# Altium schematic sheet Gas_Sampler-Flow_Sensor.SchDoc: Flow Sensor
size Tabloid; Organization: Sensible Robotics LLC; Address1: 120 E Church Ave Suite B; Address2: Ridgecrest CA, 93555; Revision: 0; SheetNumber: 12; SheetTotal: 12; ApprovedBy: Approved Name; Engineer: Mike Licitra; PageSetup: Record=PageOptions|CenterHorizontal=True|CenterVertical=True|PrintScale=0.98|XCorrection=1.00|YCorrection=1.00|PrintKind=0|BorderSize=5000000|LeftOffset=0|BottomOffset=0|Orientation=2|PaperLength=1000|PaperWidth=1000|Scale=100|PaperSource=15|PrintQuality=600|MediaType=1|DitherType=10|PaperKind=Tabloid|PrintScaleMode=1
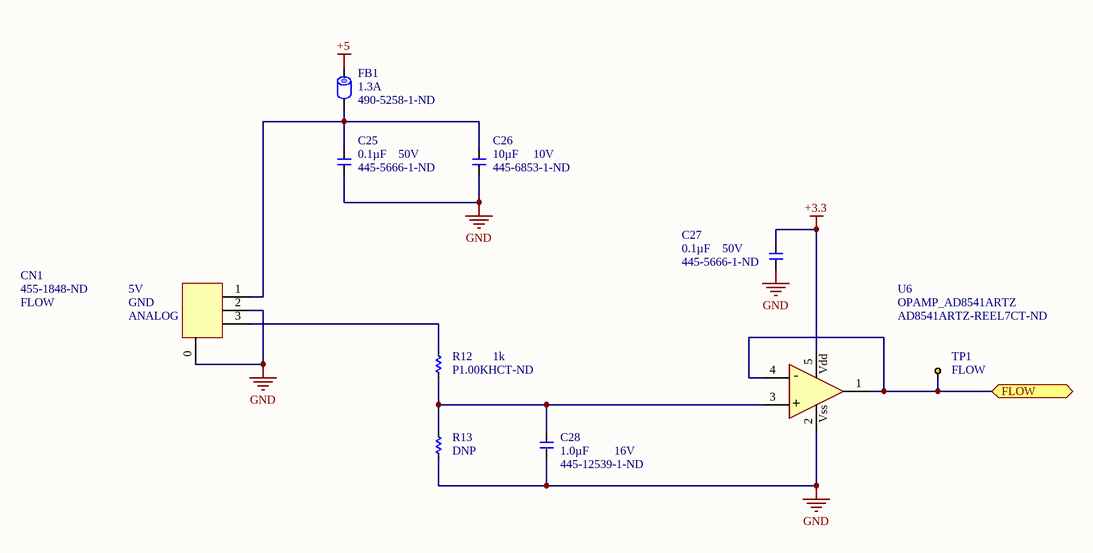
[diagram p0: Gas_Sampler-Flow_Sensor.SchDoc]

## Parts
C25  value 0.1µF  Voltage - Rated: 50V  Supplier Part Number 1: 445-5666-1-ND  [C0603]  (hidden comment: CAP_CER_0603_0.1UF_50V_10%_X7R)
C26  value 10µF  Voltage - Rated: 10V  Supplier Part Number 1: 445-6853-1-ND  [C0603]  (hidden comment: CAP_CER_0603_10UF_10V_20%_X5R)
C27  value 0.1µF  Voltage - Rated: 50V  Supplier Part Number 1: 445-5666-1-ND  [C0603]  (hidden comment: CAP_CER_0603_0.1UF_50V_10%_X7R)
C28  value 1.0µF  Supplier Part Number 1: 445-12539-1-ND  Voltage - Rated: 16V  [C0603]  (hidden comment: CAP_CER_0603_1UF_16V_10%_X7R)
CN1  FLOW  Supplier Part Number 1: 455-1848-ND  [JST_PA_S03B-PASK-2]
FB1  Current Rating (Max): 1.3A  Supplier Part Number 1: 490-5258-1-ND  [R0603]  (hidden comment: FERRITE_BEAD_0603_1.3A_600_OHM)
R12  value 1k  Supplier Part Number 1: P1.00KHCT-ND  [R0603]  (hidden comment: RES_0603_1K_OHM_1/10W_1%)
R13  value DNP  [R0603]  (hidden comment: RES_0603_DNP)  (no BOM)
TP1  FLOW  [TP_KEYSTONE_5001]
U6  OPAMP_AD8541ARTZ  Supplier Part Number 1: AD8541ARTZ-REEL7CT-ND  [5SOT23]

## Ports
FLOW

## Nets
+3.3: C27.1 U6.5(VDD)
+5: FB1.1
GND: C25.2 C26.2 C27.2 C28.2 CN1.0(CHAS) CN1.2 R13.1 U6.2(VSS)
FLOW: TP1.1 U6.1(OUT) U6.4(IN-) ; port FLOW
NetC25_1: C25.1 C26.1 CN1.1 FB1.2
NetC28_1: C28.1 R12.1 R13.2 U6.3(IN+)
NetCN1_3: CN1.3 R12.2

## Notes on the sheet
- 5V
- (near CN1) GND
- (near CN1) ANALOG
- CONFIDENTIAL DOCUMENT
- DUPLICATION PROHIBITED
- ENGINEER
- PCB FAB #
- SCH #
- REV
- Sensible
- Robotics
- THIS DOCUMENT CONTAINS INFORMATION AND OR DATA, WHICH IS PROPRIETARY AND CONFIDENTIAL TO SENSIBLE ROBOTICS LLC.  THIS INFORMATION AND OR DATA, IS TO BE USED ONLY FOR THE BENEFIT OF THE SUPPLIER, AND IS NOT TO BE USED FOR THE BENEFIT OF OTHER PARTIES WITHOUT WRITTEN CONSENT.
- DATE
- PCB ASSY #
- SIZE
- Tabloid
- SHEET
- OF
- FILE
- (in symbol OPAMP_AD8541ARTZ) Vdd; +; Vss

## Library data of the parts
C25 C27 = CAP_CER_0603_0.1UF_50V_10%_X7R: CAP CER 0.1UF 50V 10% X7R 0603; Manufacturer: TDK Corporation; Manufacturer Part Number: CGA3E2X7R1H104K080AA; Part Number: 150-00077-00; Supplier 1: Digi-Key; RoHS: RoHS Compliant; Category: Capacitors; Stock 1: 320000; Pricing 1: 1=0.1, 10=0.072, 100=0.033, 250=0.027, 500=0.0231, 1000=0.018 (USD); Packaging: Cut Tape (CT); Tolerance: ±10%; Temperature Coefficient: X7R; Mounting Type: Surface Mount, MLCC; Operating Temperature: -55°C ~ 125°C; Applications: Automotive; Ratings: AEC-Q200; Package / Case: 0603 (1608 Metric); Size / Dimension: 0.063" L x 0.031" W (1.60mm x 0.80mm); Height - Seated (Max): -; Thickness (Max): 0.035" (0.90mm); Lead Spacing: -; Features: -; Lead Style: -; ComponentLink1URL: http://product.tdk.com/capacitor/mlcc/en/documents/mlcc_automotive_general_en.pdf; ComponentLink1Description: http://product.tdk.com/capacitor/mlcc/en/documents/mlcc_automotive_general_en.pdf
C26 = CAP_CER_0603_10UF_10V_20%_X5R: CAP CER 10UF 10V X5R 0603; Manufacturer: TDK Corporation; Manufacturer Part Number: C1608X5R1A106M080AC; Tolerance: ±20%; Supplier 1: Digi-Key; RoHS: RoHS Compliant; Packaging: Cut Tape (CT); Part Status: Active; Temperature Coefficient: X5R; Operating Temperature: -55°C ~ 85°C; Features: Low ESL; Applications: General Purpose; Mounting Type: Surface Mount, MLCC; Package / Case: 0603 (1608 Metric); Size / Dimension: 0.063" L x 0.032" W (1.60mm x 0.80mm); Thickness (Max): 0.035" (0.90mm); ComponentLink1URL: https://product.tdk.com/info/en/catalog/datasheets/mlcc_commercial_general_en.pdf; ComponentLink1Description: https://product.tdk.com/info/en/catalog/datasheets/mlcc_commercial_general_en.pdf
C28 = CAP_CER_0603_1UF_16V_10%_X7R: CAP CER 1UF 16V 10% X7R 0603; Manufacturer: TDK Corporation; Manufacturer Part Number: CGA3E1X7R1C105K080AC; Supplier 1: Digi-Key; RoHS: RoHS Compliant; Packaging: Cut Tape (CT); Tolerance: ±10%; Temperature Coefficient: X7R; Mounting Type: Surface Mount, MLCC; Operating Temperature: -55°C ~ 125°C; Applications: Automotive; Ratings: AEC-Q200; Package / Case: 0603 (1608 Metric); Size / Dimension: 0.063" L x 0.031" W (1.60mm x 0.80mm); Thickness (Max): 0.035" (0.90mm); ComponentLink1URL: http://product.tdk.com/capacitor/mlcc/en/documents/mlcc_automotive_general_en.pdf; ComponentLink1Description: http://product.tdk.com/capacitor/mlcc/en/documents/mlcc_automotive_general_en.pdf
CN1 = JST_PA_RA_TH_GUIDE_3POS: CONN HEADER PA 3POS SIDE 2MM TIN; Manufacturer: JST Sales America Inc.; Manufacturer Part Number: S03B-PASK-2(LF)(SN); Connector Type: Header, Shrouded; Number of Positions: 3; Number of Positions Loaded: All; Pitch: 0.079" (2.00mm); Supplier 1: Digi-Key; Packaging: Bulk; Contact Type: Male Pin; Contact Mating Length: 0.126" (3.20mm); Mounting Type: Through Hole, Right Angle; Termination: Kinked Pin, Solder; Fastening Type: Locking Ramp; Features: Board Guide; ComponentLink1URL: http://www.jst-mfg.com/product/pdf/eng/ePA-F.pdf; ComponentLink1Description: http://www.jst-mfg.com/product/pdf/eng/ePA-F.pdf
FB1 = FERRITE_BEAD_0603_1.3A_600_OHM: FERRITE BEAD 600 OHM 0603 1LN; Manufacturer: Murata Electronics North America; Manufacturer Part Number: BLM18KG601SN1D; Filter Type: Power Line; Number of Lines: 1; Impedance @ Frequency: 600 Ohm @ 100MHz; DC Resistance (DCR) (Max): 150 mOhm; Supplier 1: Digi-Key; RoHS: RoHS Compliant; Category: Filters; Stock 1: 300163; Packaging: Cut Tape (CT); Operating Temperature: -55°C ~ 125°C; Package / Case: 0603 (1608 Metric); Mounting Type: Surface Mount; Height (Max): 0.037" (0.95mm); Size / Dimension: 0.063" L x 0.032" W (1.60mm x 0.80mm); ComponentLink1URL: http://media.digikey.com/pdf/Data%20Sheets/Murata%20PDFs/BLM18yyyyyyN1x.pdf; ComponentLink1Description: http://media.digikey.com/pdf/Data%20Sheets/Murata%20PDFs/BLM18yyyyyyN1x.pdf
R12 = RES_0603_1K_OHM_1/10W_1%: RES 1K OHM 1/10W 1% 0603 SMD; Manufacturer: Panasonic Electronic Components; Manufacturer Part Number: ERJ-3EKF1001V; Power (Watts): 0.1W, 1/10W; Temperature Coefficient: ±100ppm/°C; Supplier 1: Digi-Key; RoHS: RoHS Compliant; Packaging: Cut Tape (CT); Composition: Thick Film; Features: -; Tolerance: ±1%; Package / Case: 0603 (1608 Metric); Supplier Device Package: 0603; Size / Dimension: 0.063" L x 0.031" W (1.60mm x 0.80mm); Height: 0.022" (0.55mm); Number of Terminations: 2; ComponentLink1URL: http://industrial.panasonic.com/www-cgi/jvcr13pz.cgi?E+PZ+3+AOA0002+ERJ3EKF1001V+7+WW; ComponentLink1Description: http://industrial.panasonic.com/www-cgi/jvcr13pz.cgi?E+PZ+3+AOA0002+ERJ3EKF1001V+7+WW
R13 = RES_0603_DNP: RES DNP 0603 SMD; Part Number: 000-00000-00; Supplier 1: Digi-Key; Supplier Part Number 1: DNP
TP1 = TEST_KEYSTONE5001: PC TEST POINT TH RING; Manufacturer: Keystone Electronics; Manufacturer Part Number: 5001; Part Number: 250-00184-00; Supplier 1: Digi-Key; Supplier Part Number 1: 5001K-ND; RoHS: RoHS Compliant; Category: Test and Measurement; Stock 1: 341830; Pricing 1: 1=0.33, 10=0.309, 50=0.2252, 100=0.2164, 250=0.19432, 500=0.18548, 1000=0.15456, 2500=0.14131, 5000=0.13248 (USD); Packaging: Bulk; Type: PC Test Point, Miniature; Terminal: 0.010" x 0.020" (0.25mm x 0.51mm) Phosphor Bronze Wire, Silver Plate; Mounting Type: 0.040" (1.02mm) Hole Diameter; Material: Base, Nylon 46, UL 94V-0; Color: Black; ComponentLink1URL: http://www.keyelco.com/product-pdf.cfm?p=1310; ComponentLink1Description: http://www.keyelco.com/product-pdf.cfm?p=1310
U6 = OPAMP_AD8541ARTZ: IC OPAMP GP R-R CMOS SOT23-5; Manufacturer: Analog Devices Inc; Manufacturer Part Number: AD8541ARTZ-REEL7; Part Number: 480-00120-00; Amplifier Type: General Purpose; Number of Circuits: 1; Output Type: Rail-to-Rail; Slew Rate: 0.92 V/µs; Gain Bandwidth Product: 1MHz; Current - Input Bias: 4pA; Voltage - Input Offset: 1mV; Current - Supply: 45µA; Current - Output / Channel: 30mA; Voltage - Supply, Single/Dual (±): 2.7 V ~ 5.5 V; Supplier 1: Digi-Key; RoHS: RoHS Compliant; Category: Integrated Circuits (ICs); Stock 1: 26612; Pricing 1: 1=0.85, 10=0.747, 25=0.6604, 100=0.5755, 250=0.50096, 500=0.42642, 1000=0.34155 (USD); Packaging: Cut Tape (CT); -3db Bandwidth: -; Operating Temperature: -40°C ~ 125°C; Mounting Type: Surface Mount; Package / Case: SC-74A, SOT-753; Supplier Device Package: SOT-23-5; ComponentLink1URL: http://www.analog.com/static/imported-files/data_sheets/AD8541_8542_8544.pdf; ComponentLink1Description: http://www.analog.com/static/imported-files/data_sheets/AD8541_8542_8544.pdf